# EAGLE design 20190105_ORIGAMI_V1-V-3 (EAGLE 9.2.2)
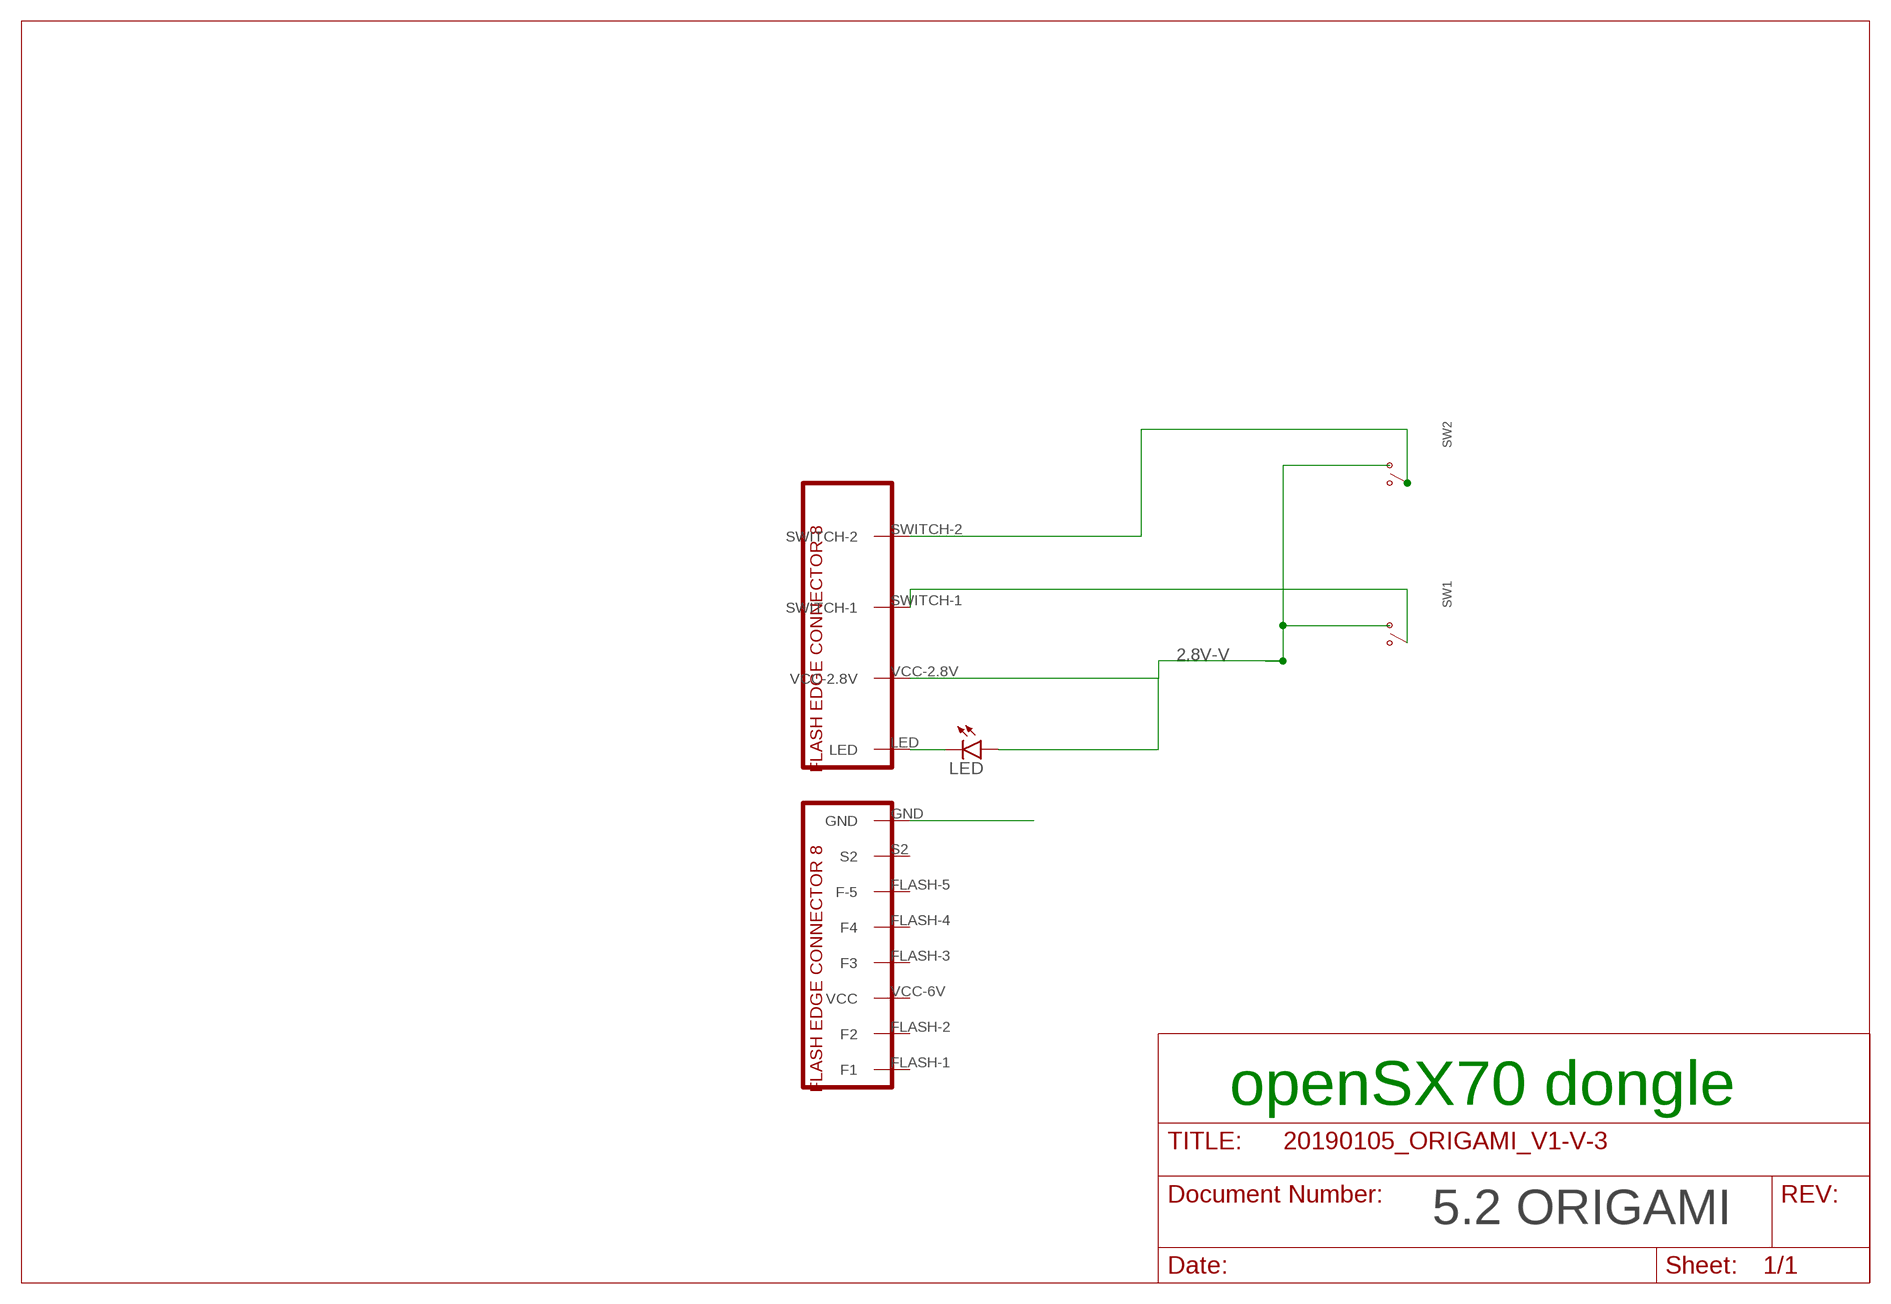
[diagram p0: schematic, sheet 1]

## Parts
LED  LEDCHIP-LED0805  [CHIP-LED0805]
SW1  MK-12C02 G1.5  K3-1280S-SHORTSMALL  [K3-1280S-SMALL]
SW2  MK-12C02 G1.5  K3-1280S-SHORTSMALL  [K3-1280S-SMALL]
U$1  FLASH-BRIDGE-SW1-SW2-LED-SMALL-NO-GND  [FLASH-8-BRIDGE-SW1-SW2-LED-SMALL-NO-GND]
U$2  SX70-FLASH-EDGE8-MALE-LONG  [SX70-FLASH-EDGE8-2]

## Nets
2.8V-V: LED.A SW1.P$3(B) SW2.P$3(B) U$1.VCC-2.8V
N$1: U$2.GND
N$2: SW2.P$2(COM) U$1.SWITCH-2
N$4: LED.C U$1.LED
N$5: SW1.P$2(COM) U$1.SWITCH-1
Unconnected: SW1.P$1(A) SW2.P$1(A) U$2.FLASH-1(F1) U$2.FLASH-2(F2) U$2.FLASH-3(F3) U$2.FLASH-4(F4) U$2.FLASH-5(F-5) U$2.S2 U$2.VCC-6V(VCC)

## Notes on the sheet
- openSX70 dongle
- 5.2 ORIGAMI

## Library data of the parts
LED = led:LED: LED OSRAM: - CHIPLED LG R971, LG N971, LY N971, LG Q971, LY Q971, LO R971, LY R971 LH N974, LH R974 LS Q976, LO Q976, LY Q976 LO Q996 - Hyper CHIPLED LW Q18S LB Q993, LB Q99A, LB R99A - SideLED LS A670, LO A670, LY A670, LG A670, LP A670 LB A673, LV A673, LT A673, LW A673 LH A674 LY A675 LS A676, LA A676, LO A676, LY A676, LW A676 LS A679, LY A679, LG A679 - Hyper Micro SIDELED® LS Y876, LA Y876, LO Y876, LY Y876 LT Y87S - SmartLED LW L88C, LW L88S LB L89C, LB L89S, LG L890 LS L89K, LO L89K, LY L89K LS L896, LA L896, LO L896, LY L896 - TOPLED LS T670, LO T670, LY T670, LG T670, LP T670 LSG T670, LSP T670, LSY T670, LOP T670, LYG T670 LG T671, LOG T671, LSG T671 LB T673, LV T673, LT T673, LW T673 LH T674 LS T676, LA T676, LO T676, LY T676, LB T676, LH T676, LSB T676, LW T676 LB T67C, LV T67C, LT T67C, LS T67K, LO T67K, LY T67K, LW E67C LS E67B, LA E67B, LO E67B, LY E67B, LB E67C, LV E67C, LT E67C LW T67C LS T679, LY T679, LG T679 LS T770, LO T770, LY T770, LG T770, LP T770 LB T773, LV T773, LT T773, LW T773 LH T774 LS E675, LA E675, LY E675, LS T675 LS T776, LA T776, LO T776, LY T776, LB T776 LHGB T686 LT T68C, LB T68C - Hyper Mini TOPLED® LB M676 - Mini TOPLED Santana® LG M470 LS M47K, LO M47K, LY M47K Source: http://www.osram.convergy.de LUXEON: - LUMILED® LXK2-PW12-R00, LXK2-PW12-S00, LXK2-PW14-U00, LXK2-PW14-V00 LXK2-PM12-R00, LXK2-PM12-S00, LXK2-PM14-U00 LXK2-PE12-Q00, LXK2-PE12-R00, LXK2-PE12-S00, LXK2-PE14-T00, LXK2-PE14-U00 LXK2-PB12-K00, LXK2-PB12-L00, LXK2-PB12-M00, LXK2-PB14-N00, LXK2-PB14-P00, LXK2-PB14-Q00 LXK2-PR12-L00, LXK2-PR12-M00, LXK2-PR14-Q00, LXK2-PR14-R00 LXK2-PD12-Q00, LXK2-PD12-R00, LXK2-PD12-S00 LXK2-PH12-R00, LXK2-PH12-S00 LXK2-PL12-P00, LXK2-PL12-Q00, LXK2-PL12-R00 Source: www.luxeon.com KINGBRIGHT: KA-3528ASYC Source: www.kingbright.com
SW1 SW2 = _openSX70:K3-1280S-SHORT
U$1 = _openSX70:FLASH-BRIDGE-SW1-SW2-LED-SMALL-NO-GND
U$2 = _openSX70:SX70-FLASH-EDGE8-MALE-LONG

## Net classes
0 GND: width 0.305 mm
1 VCC: width 0.254 mm
2 2.8V: width 0.254 mm

## Board
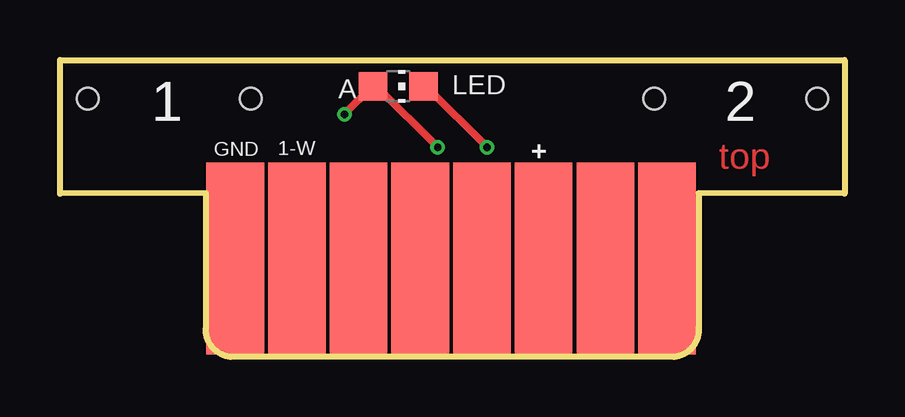
[diagram p1: board, top side]
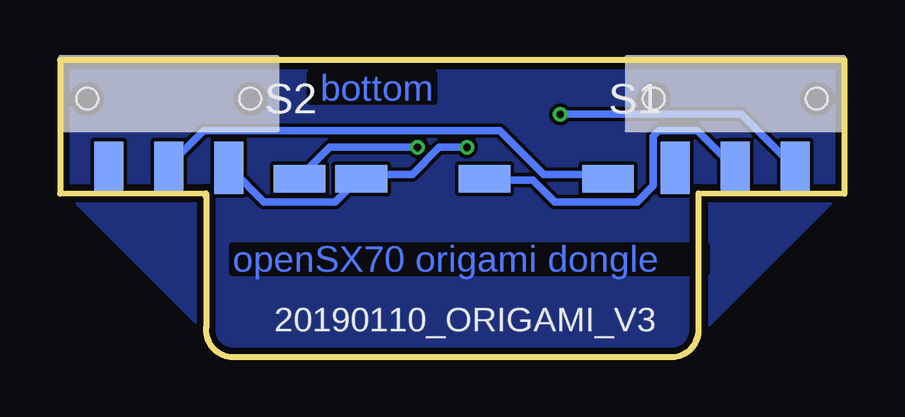
[diagram p2: board, bottom side, seen from below]

Size 32.69 x 12.39 mm. Coordinates in mm from the lower left corner, seen from the top.
Outline: 26.61,6.83 26.61,1.25 arc-90 25.59,0 7.1,0 arc-90 6.08,1.25 6.08,6.83 0,6.8 0,12.39 32.69,12.39 32.69,6.8 26.61,6.83
Outline: 26.61,6.83 26.63,6.71
Copper layers (1*16): Top 0.035mm / dielectric 1.5mm / Bottom 0.035mm
Design rules "SeeedStudio_2layer_DRU_no_angle_20140221": minimum track width 6mil, minimum drill 12mil, track to track 6mil, track to pad 6mil, pad to pad 6mil, via to via 6mil, smd to smd 0mil, copper to edge 10mil, drill to drill 10mil, minimum pad ring 10mil, minimum via ring 6mil, stop-mask expansion 2mil, vias tented up to drill 100mil, thermal gap 10mil

### Footprints (pad centres in the part's own frame; a part is rotated, then mirrored left to right if it is on the bottom)
CHIP-LED0805 = smd 1.2 x 1.2: A 0,-1.05; C 0,1.05
K3-1280S-SMALL = smd 1.2 x 2.2: P$1 -2.5,-3.61; P$2 0,-3.61; P$3 2.5,-3.61 | hole 0.9: -3.4,-0.735; 3.4,-0.735
FLASH-8-BRIDGE-SW1-SW2-LED-SMALL-NO-GND = smd 2.159 x 1.143: LED 6.42,4.96; SWITCH-1 -1.29,4.96; SWITCH-2 -6.43,4.96; VCC-2.8V 3.85,4.96
SX70-FLASH-EDGE8-2 = smd 2.4 x 8: FLASH-1 8.99,7.5; FLASH-2 6.42,7.5; FLASH-3 1.28,7.5; FLASH-4 -1.29,7.5; FLASH-5 -3.86,7.5; GND -9,7.5; S2 -6.43,7.5; VCC-6V 3.85,7.5

### Placement (x,y rotation side)
LED  14.09,11.29 270 top
SW1  4.56,11.5 0 bottom
SW2  28.16,11.5 0 bottom
U$1  16.29,12.39 180 bottom
U$2  16.3,-3.4 0 top

### Tracks (layer width: path | path; a pad name or v marks a point on that pad's centre or on a via)
2.8V-V  (via drill 0.3)
  Top 0.305: v15.74,8.74 13.22,11.26 LED.A 12.99,11.26 v11.85,10.12
  Bottom 0.305: v15.74,8.74 16.88,8.74 18.02,7.6 20.08,7.6 U$1.VCC-2.8V 20.31,7.37 21.22,6.46 24.2,6.46 25.57,7.83 SW2.P$3 | v11.85,10.12 4.31,10.12 2.25,8.06 SW1.P$3
GND
  pour Bottom: 0.09,12.29 0.09,6.89 6.99,-0.01 25.19,-0.01 25.39,-0.21 32.39,6.79 32.79,6.79 32.79,12.19 32.69,12.29
N$2
  Bottom 0.305: U$1.SWITCH-2 10.02,7.6 12.54,7.6 14.37,9.43 26.71,9.43 28.08,8.06 SW2.P$2
N$4  (via drill 0.3)
  Top 0.305: v17.79,8.74 15.28,11.26 LED.C
  Bottom 0.305: v17.79,8.74 21.45,8.74 22.59,7.6 U$1.LED
N$5
  Bottom 0.305: U$1.SWITCH-1 14.82,7.37 12.99,7.37 12.08,6.46 8.65,6.46 7.96,7.14 7.96,9.2 7.74,9.43 6.14,9.43 4.76,8.06 SW1.P$2

### Text on the board
Top: top
Bottom: bottom | openSX70 origami dongle
tPlace: +
bPlace: 20190110_ORIGAMI_V3
tNames: A | 1 | 2 | GND | 1-W
bNames: S1 | S2